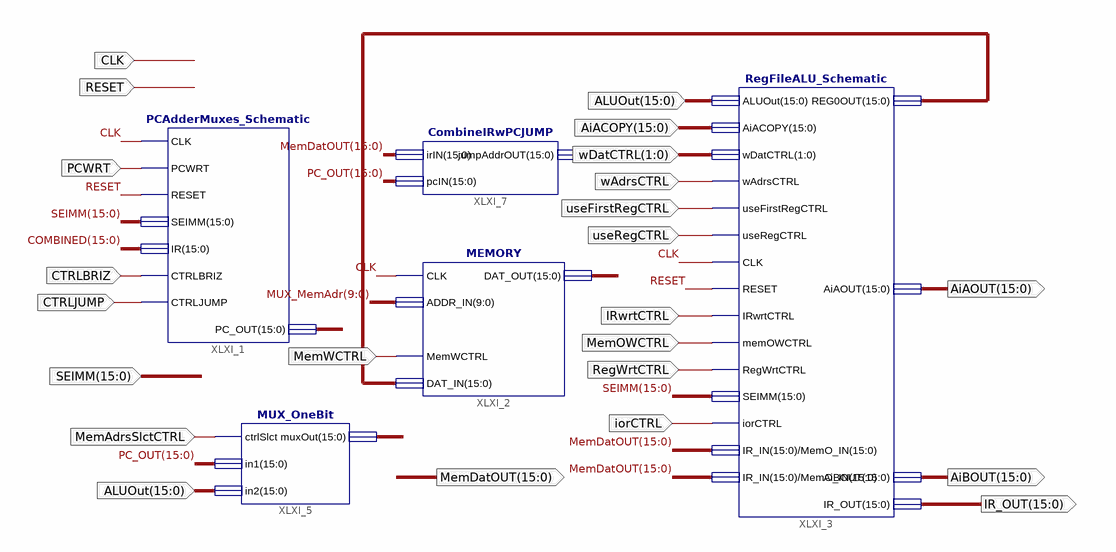
[diagram p0: schematic sheet 1]
// Xilinx ISE schematic PCAddMuxMem_Schematic.sch (spartan3e) as structural Verilog: 5 symbols, 22 ports
module PCAddMuxMem_Schematic (
  input  [15:0] AiACOPY,
  input  [1:0] wDatCTRL,
  input  wAdrsCTRL,
  input  useFirstRegCTRL,
  input  useRegCTRL,
  input  IRwrtCTRL,
  input  MemOWCTRL,
  input  RegWrtCTRL,
  input  iorCTRL,
  input  CTRLJUMP,
  input  CTRLBRIZ,
  input  PCWRT,
  input  CLK,
  input  RESET,
  input  MemWCTRL,
  input  [15:0] ALUOut,
  input  MemAdrsSlctCTRL,
  input  [15:0] SEIMM,
  output [15:0] AiAOUT,
  output [15:0] AiBOUT,
  output [15:0] MemDatOUT,
  output [15:0] IR_OUT
);

  wire [15:0] COMBINED, MUX_MemAdr, PC_OUT, XLXN_24;

  PCAdderMuxes_Schematic XLXI_1 (
    .CLK(CLK), .PCWRT(PCWRT), .RESET(RESET), .SEIMM(SEIMM), .IR(COMBINED), .CTRLBRIZ(CTRLBRIZ),
    .CTRLJUMP(CTRLJUMP), .PC_OUT(PC_OUT));
  RegFileALU_Schematic XLXI_3 (
    .ALUOut(ALUOut), .AiACOPY(AiACOPY), .wDatCTRL(wDatCTRL), .wAdrsCTRL(wAdrsCTRL),
    .useFirstRegCTRL(useFirstRegCTRL), .useRegCTRL(useRegCTRL), .CLK(CLK), .RESET(RESET),
    .IRwrtCTRL(IRwrtCTRL), .memOWCTRL(MemOWCTRL), .RegWrtCTRL(RegWrtCTRL), .SEIMM(SEIMM), .iorCTRL(iorCTRL),
    .IR_IN(MemDatOUT), .MemO_IN(MemDatOUT), .REG0OUT(XLXN_24), .AiAOUT(AiAOUT), .AiBOUT(AiBOUT),
    .IR_OUT(IR_OUT));
  MEMORY XLXI_2 (.CLK(CLK), .ADDR_IN(MUX_MemAdr[9:0]), .MemWCTRL(MemWCTRL), .DAT_OUT(MemDatOUT), .DAT_IN(XLXN_24));
  MUX_OneBit XLXI_5 (.ctrlSlct(MemAdrsSlctCTRL), .in1(PC_OUT), .in2(ALUOut), .muxOut(MUX_MemAdr));
  CombineIRwPCJUMP XLXI_7 (.irIN(MemDatOUT), .pcIN(PC_OUT), .jumpAddrOUT(COMBINED));
endmodule
